# Altium schematic sheet Relay.SchDoc
size A
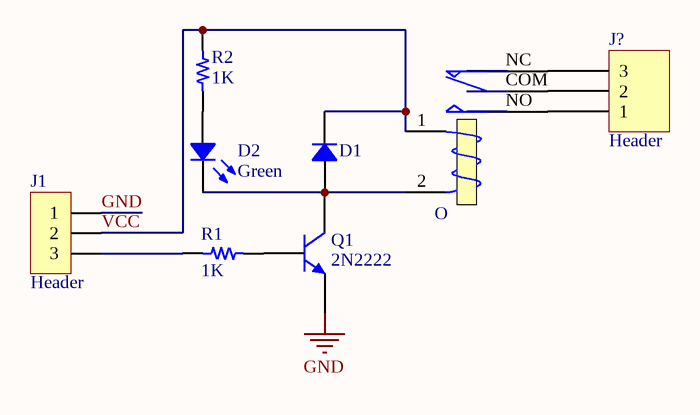
[diagram p0: Relay.SchDoc]

## Parts
D1  (no value)  [SOD123F]
D2  Green  [LED 1206/3216 RED]
J1  Header  [MOLEX SDA-70553-3PIN]
J?  Header  [MOLEX KK 0022272031]
O  12V SMALL  [Relay_5_Small]  (value not drawn)
Q1  2N2222  [T4-TO92]
R1  1K  [RES 1206/3216]
R2  1K  [RES 1206/3216]

## Nets
GND: J1.1 Q1.E
VCC: D1.2 J1.2 O.1 R2.1
NetD1_1: D1.1 D2.2 O.2 Q1.C
NetD2_1: D2.1 R2.2
NetJ1_3: J1.3 R1.2
NetJ?_1: J?.1 O.NO
NetJ?_2: J?.2 O.COM
NetJ?_3: J?.3 O.NC
NetQ1_B: Q1.B R1.1

## Library data of the parts
D1 = Diode: Rectifier Diode
D2 = LED: Chip LED; Value: Green
J1 J? = 3 Pin
O = Small Relay: Manufacturer: TIANBO; Manufacture Part #: HJR-78F-12VDC-S-Z; Rating: 7A, 120VAC; Link to Datasheet: *; Link to Picture: *; Operating Temp: -40°C to +85°C; Storage Temp: -40°C to +105°C; Tolerance: *; ComponentLink1Description: *; ComponentLink1URL: *; Value: 12V SMALL
Q1 = 2N2222: NPN; E-mail: picpars@gmail.com; De: Seyed Mohsen Ghasemian; web: www.picpars.com
R1 R2 = Resistor: SMT Resistor; Value: 1K